# Altium schematic sheet GSB-S02-V00-Microcontroller.SchDoc: General Sensor Board
size A3; DrawnBy: Zoe Goodward; Revision: 01; SheetNumber: 1; SheetTotal: 1; Version: 01; Project: Battery Managment System 2020; PageSetup: Record=PageOptions|CenterHorizontal=True|CenterVertical=True|PrintScale=0.97|XCorrection=1.00|YCorrection=1.00|PrintKind=0|BorderSize=5000000|LeftOffset=0|BottomOffset=0|Orientation=2|PaperLength=1000|PaperWidth=1000|Scale=100|PaperSource=7|PrintQuality=-4|MediaType=1|DitherType=10|PaperKind=A4|PrintScaleMode=1
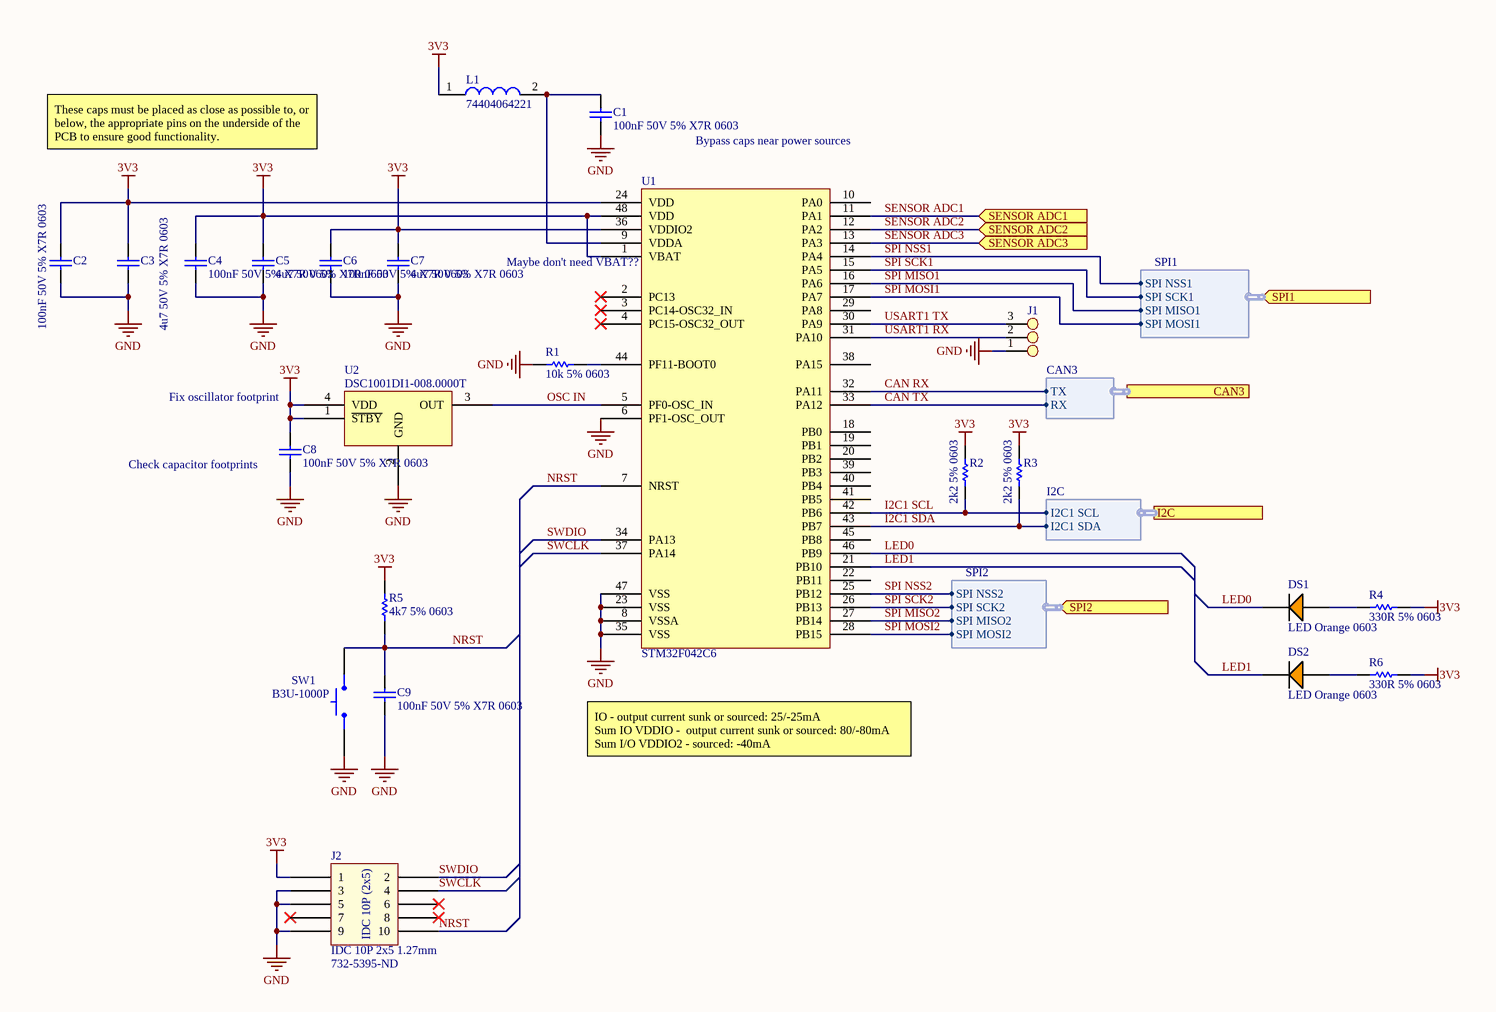
[diagram p0: GSB-S02-V00-Microcontroller.SchDoc]

## Parts
C1  100nF 50V 5% X7R 0603  [Cap_Ceramic_0603]
C2  100nF 50V 5% X7R 0603  [Cap_Ceramic_0603]
C3  4u7 50V 5% X7R 0603  [Cap_Ceramic_0603]
C4  100nF 50V 5% X7R 0603  [Cap_Ceramic_0603]
C5  4u7 50V 5% X7R 0603  [Cap_Ceramic_0603]
C6  100nF 50V 5% X7R 0603  [Cap_Ceramic_0603]
C7  4u7 50V 5% X7R 0603  [Cap_Ceramic_0603]
C8  100nF 50V 5% X7R 0603  [Cap_Ceramic_0603]
C9  100nF 50V 5% X7R 0603  [Cap_Ceramic_0603]
DS1  LED Orange 0603  [LED ORANGE 0603]
DS2  LED Orange 0603  [LED ORANGE 0603]
J1  Jumper 3Way Pins  [Jumper_3Way_Pin]  (value not drawn)
J2  IDC 10P 2x5 1.27mm  [IDC 1.27MM 10P]
L1  74404064221  [Inductor_6x6mm]
R1  10k 5% 0603  [Res_ThinFilm_0603]
R2  2k2 5% 0603  [Res_ThinFilm_0603]
R3  2k2 5% 0603  [Res_ThinFilm_0603]
R4  330R 5% 0603  [Res_ThinFilm_0603]
R5  4k7 5% 0603  [Res_ThinFilm_0603]
R6  330R 5% 0603  [Res_ThinFilm_0603]
SW1  B3U-1000P  [BTN B3U-1000P]
U1  STM32F042C6  [STM32F042C6]
U2  DSC1001DI1-008.0000T  [DSC1001DI1-008.0000TCT-ND]

## Ports
CAN3 (harness CAN3), I2C (harness I2C), SENSOR ADC1 (in), SENSOR ADC2 (in), SENSOR ADC3 (in), SPI1 (in, harness SPI1), SPI2 (in, harness SPI2)

## Harnesses
I2C: I2C1 SCL, I2C1 SDA
CAN3: RX, TX
SPI1: SPI SCK1, SPI MISO1, SPI NSS1, SPI MOSI1
SPI2: SPI SCK2, SPI MISO2, SPI NSS2, SPI MOSI2

## Nets
3V3: C2.2 C3.2 C4.2 C5.2 C6.2 C7.2 C8.2 J2.1 L1.1 R2.2 R3.2 R4.2 R5.2 R6.2 U1.1(VBAT) U1.24(VDD) U1.36(VDDIO2) U1.48(VDD) U2.1(~{STBY}) U2.4(VDD)
GND: C1.1 C2.1 C3.1 C4.1 C5.1 C6.1 C7.1 C8.1 C9.1 J1.1 J2.3 J2.5 J2.9 R1.1 SW1.1 U1.6(PF1-OSC_OUT) U1.8(VSSA) U1.23(VSS) U1.35(VSS) U1.47(VSS) U2.2(GND)
CAN RX: U1.32(PA11) ; port CAN3.TX
CAN TX: U1.33(PA12) ; port CAN3.RX
I2C1 SCL: R2.1 U1.42(PB6) ; port I2C.I2C1 SCL
I2C1 SDA: R3.1 U1.43(PB7) ; port I2C.I2C1 SDA
LED0: DS1.2(C) U1.46(PB9)
LED1: DS2.2(C) U1.21(PB10)
NRST: C9.2 J2.10 R5.1 SW1.2 U1.7(NRST)
OSC IN: U1.5(PF0-OSC_IN) U2.3(OUT)
SENSOR ADC1: U1.11(PA1) ; port SENSOR ADC1
SENSOR ADC2: U1.12(PA2) ; port SENSOR ADC2
SENSOR ADC3: U1.13(PA3) ; port SENSOR ADC3
SPI MISO1: U1.16(PA6) ; port SPI1.SPI MISO1
SPI MISO2: U1.27(PB14) ; port SPI2.SPI MISO2
SPI MOSI1: U1.17(PA7) ; port SPI1.SPI MOSI1
SPI MOSI2: U1.28(PB15) ; port SPI2.SPI MOSI2
SPI NSS1: U1.14(PA4) ; port SPI1.SPI NSS1
SPI NSS2: U1.25(PB12) ; port SPI2.SPI NSS2
SPI SCK1: U1.15(PA5) ; port SPI1.SPI SCK1
SPI SCK2: U1.26(PB13) ; port SPI2.SPI SCK2
SWCLK: J2.4 U1.37(PA14)
SWDIO: J2.2 U1.34(PA13)
USART1 RX: J1.2 U1.31(PA10)
USART1 TX: J1.3 U1.30(PA9)
NetC1_2: C1.2 L1.2 U1.9(VDDA)
NetDS1_1: DS1.1(A) R4.1
NetDS2_1: DS2.1(A) R6.1
NetR1_2: R1.2 U1.44(PF11-BOOT0)

Not connected (* = marked no-connect by the designer): J2 6* 7* 8*; U1 2(PC13)* 3(PC14-OSC32_IN)* 4(PC15-OSC32_OUT)* 10(PA0) 18(PB0) 19(PB1) 20(PB2) 22(PB11) 29(PA8) 38(PA15) 39(PB3) 40(PB4) 41(PB5) 45(PB8)

## Notes on the sheet
- These caps must be placed as close as possible to, or below, the appropriate pins on the underside of the PCB to ensure good functionality.
- Bypass caps near power sources
- (near U1) Maybe don't need VBAT??
- Fix oscillator footprint
- (near C8) Check capacitor footprints
- IO - output current sunk or sourced: 25/-25mA
  Sum IO VDDIO -  output current sunk or sourced: 80/-80mA
  Sum I/O VDDIO2 - sourced: -40mA
- (near J2) 732-5395-ND
- Revision History:
- Sheet Title:
- Rev
- Date
- Description
- Project:
- Size:
- Drawn By:
- A3
- Number:
- Revision:
- Sheet
- Version:
- of
- QUT Motorsport
- O-120, Gardens Point
- 2 George Street
- Brisbane, QLD 4000
- Australia
- Print Date:
- Print Time:
- File Name:
- (in symbol IDC 10P 2x5 1.27mm) IDC 10P (2x5)

## Library data of the parts
C1 C2 C4 C6 C8 C9 = 100nF 50V 5% X7R 0603: Capacitor, Ceramic, SMD, 100nF, 50V, 5%, X7R, 0603
C3 C5 C7 = 4u7 50V 5% X7R 0603: Capacitor, Ceramic, SMD, 4u7, 50V, 5%, X7R, 0603
J1 = Jumper 3Way Side Pins
L1 = 74404064221: FIXED IND 220UH 660MA 850 MOHM; ComponentLink1Description: Digikey; ComponentLink1URL: https://www.digikey.com.au/product-detail/en/w%C3%BCrth-elektronik/74404064221/732-7261-1-ND/5353241; ComponentLink2Description: LCSC A; ComponentLink2URL: https://lcsc.com/product-detail/Power-Inductors_Sunlord-SWPA6045S221MT_C91047.html; ComponentLink3Description: LCSC B; ComponentLink3URL: https://lcsc.com/product-detail/Power-Inductors_SXN-Shun-Xiang-Nuo-Elec-SMNR6045-221MT_C467145.html
R1 = 10k 5% 0603: Resistor, SMD, 10k, 0.1W, 5%, 0603
R2 R3 = 2k2 5% 0603: Resistor, SMD, 2k2, 0.1W, 5%, 0603
R4 R6 = 330R 5% 0603: Resistor, SMD, 330R, 0.1W, 5%, 0603
R5 = 4k7 5% 0603: Resistor, SMD, 4k7, 0.1W, 5%, 0603
SW1 = BTN B3U-1000P: Omron B3U-1000P Ultra Miniture Switch; ComponentLink1Description: LCSC; ComponentLink1URL: https://lcsc.com/product-detail/Tactile-Switches_BRIGHT-TSA063G50-250_C294565.html
U1 = STM32F042C6: ARM® Cortex®-M0 STM32F0 Microcontroller IC 32-Bit 48MHz 32KB (32K x 8) FLASH 48-LQFP (7x7); ComponentLink1Description: Digikey; ComponentLink1URL: https://www.digikey.com.au/product-detail/en/stmicroelectronics/STM32F042C6T6TR/497-19319-1-ND/10063344; ComponentLink2Description: Datasheet; ComponentLink2URL: https://www.st.com/resource/en/datasheet/stm32f042k6.pdf
U2 = DSC1001DI1-008.0000T: 8MHz XO (Standard) CMOS Oscillator 1.8 ~ 3.3V Standby (Power Down) 4-SMD, No Lead